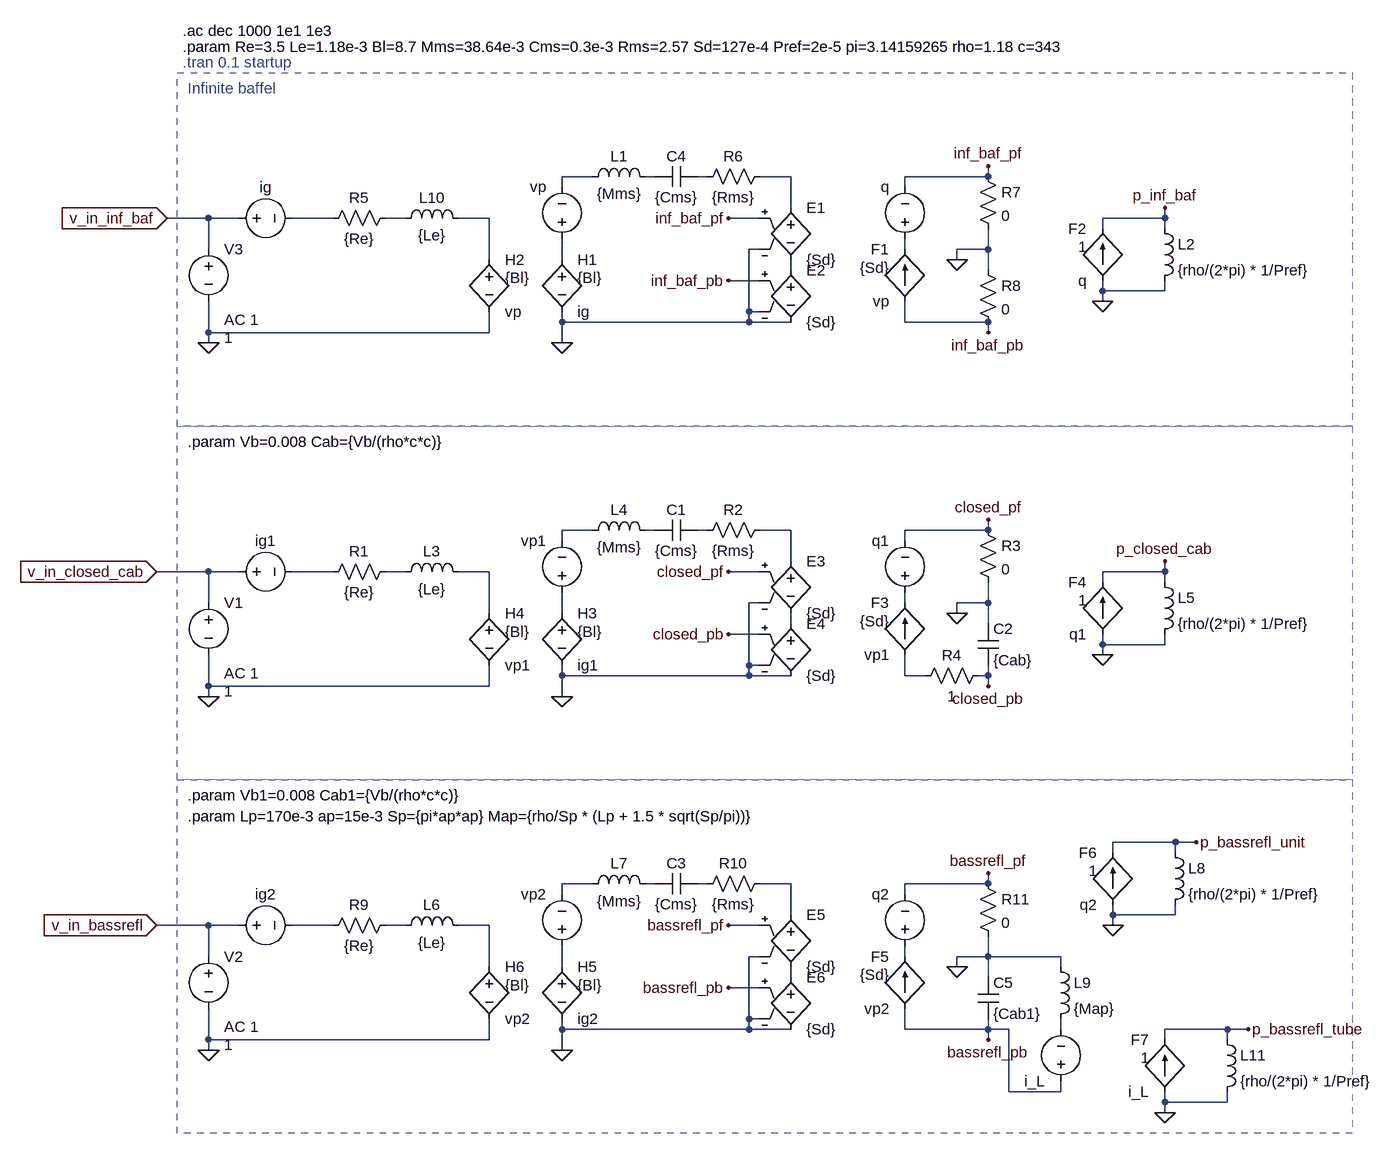
[diagram p0: schematic sim.asc]
sim.asc, the LTspice schematic file:
Version 4
SHEET 1 2408 1124
WIRE 704 -384 656 -384
WIRE 800 -384 784 -384
WIRE 880 -384 864 -384
WIRE 1008 -384 960 -384
WIRE 1312 -384 1312 -400
WIRE 1312 -384 1184 -384
WIRE 656 -368 656 -384
WIRE 1184 -368 1184 -384
WIRE 1008 -336 1008 -384
WIRE 112 -320 48 -320
WIRE 160 -320 112 -320
WIRE 304 -320 240 -320
WIRE 416 -320 384 -320
WIRE 544 -320 496 -320
WIRE 960 -320 912 -320
WIRE 1584 -320 1584 -336
WIRE 1584 -320 1488 -320
WIRE 1488 -304 1488 -320
WIRE 1584 -304 1584 -320
WIRE 112 -272 112 -320
WIRE 960 -272 944 -272
WIRE 1184 -272 1184 -288
WIRE 1312 -272 1312 -304
WIRE 1312 -272 1264 -272
WIRE 544 -256 544 -320
WIRE 656 -256 656 -288
WIRE 1264 -256 1264 -272
WIRE 1008 -240 1008 -256
WIRE 1312 -240 1312 -272
WIRE 960 -224 912 -224
WIRE 1488 -208 1488 -224
WIRE 1584 -208 1584 -224
WIRE 1584 -208 1488 -208
WIRE 1488 -192 1488 -208
WIRE 944 -176 944 -272
WIRE 960 -176 944 -176
WIRE 656 -160 656 -176
WIRE 944 -160 944 -176
WIRE 944 -160 656 -160
WIRE 1008 -160 944 -160
WIRE 1184 -160 1184 -192
WIRE 1312 -160 1184 -160
WIRE 112 -144 112 -192
WIRE 544 -144 544 -176
WIRE 544 -144 112 -144
WIRE 1312 -144 1312 -160
WIRE 112 -128 112 -144
WIRE 656 -128 656 -160
WIRE 704 160 656 160
WIRE 800 160 784 160
WIRE 880 160 864 160
WIRE 1008 160 960 160
WIRE 1312 160 1312 144
WIRE 1312 160 1184 160
WIRE 656 176 656 160
WIRE 1184 176 1184 160
WIRE 1008 208 1008 160
WIRE 112 224 32 224
WIRE 160 224 112 224
WIRE 304 224 240 224
WIRE 416 224 384 224
WIRE 544 224 496 224
WIRE 960 224 912 224
WIRE 1584 224 1584 208
WIRE 1584 224 1488 224
WIRE 1488 240 1488 224
WIRE 1584 240 1584 224
WIRE 112 272 112 224
WIRE 960 272 944 272
WIRE 1184 272 1184 256
WIRE 1312 272 1312 240
WIRE 1312 272 1264 272
WIRE 544 288 544 224
WIRE 656 288 656 256
WIRE 1264 288 1264 272
WIRE 1008 304 1008 288
WIRE 1312 304 1312 272
WIRE 960 320 912 320
WIRE 1488 336 1488 320
WIRE 1584 336 1584 320
WIRE 1584 336 1488 336
WIRE 1488 352 1488 336
WIRE 944 368 944 272
WIRE 960 368 944 368
WIRE 656 384 656 368
WIRE 944 384 944 368
WIRE 944 384 656 384
WIRE 1008 384 944 384
WIRE 1184 384 1184 352
WIRE 1216 384 1184 384
WIRE 1312 384 1312 368
WIRE 1312 384 1296 384
WIRE 112 400 112 352
WIRE 544 400 544 368
WIRE 544 400 112 400
WIRE 1312 400 1312 384
WIRE 112 416 112 400
WIRE 656 416 656 384
WIRE 1600 640 1504 640
WIRE 1632 640 1600 640
WIRE 1504 656 1504 640
WIRE 1600 656 1600 640
WIRE 704 704 656 704
WIRE 800 704 784 704
WIRE 880 704 864 704
WIRE 1008 704 960 704
WIRE 1312 704 1312 688
WIRE 1312 704 1184 704
WIRE 656 720 656 704
WIRE 1184 720 1184 704
WIRE 1008 752 1008 704
WIRE 1504 752 1504 736
WIRE 1600 752 1600 736
WIRE 1600 752 1504 752
WIRE 112 768 32 768
WIRE 160 768 112 768
WIRE 304 768 240 768
WIRE 416 768 384 768
WIRE 544 768 496 768
WIRE 960 768 912 768
WIRE 1504 768 1504 752
WIRE 112 816 112 768
WIRE 960 816 944 816
WIRE 1184 816 1184 800
WIRE 1312 816 1312 784
WIRE 1312 816 1264 816
WIRE 1424 816 1312 816
WIRE 544 832 544 768
WIRE 656 832 656 800
WIRE 1264 832 1264 816
WIRE 1424 832 1424 816
WIRE 1008 848 1008 832
WIRE 1312 848 1312 816
WIRE 960 864 912 864
WIRE 944 912 944 816
WIRE 960 912 944 912
WIRE 656 928 656 912
WIRE 944 928 944 912
WIRE 944 928 656 928
WIRE 1008 928 944 928
WIRE 1184 928 1184 896
WIRE 1312 928 1312 912
WIRE 1312 928 1184 928
WIRE 1344 928 1312 928
WIRE 1424 928 1424 912
WIRE 1680 928 1584 928
WIRE 1712 928 1680 928
WIRE 112 944 112 896
WIRE 544 944 544 912
WIRE 544 944 112 944
WIRE 1312 944 1312 928
WIRE 1584 944 1584 928
WIRE 1680 944 1680 928
WIRE 112 960 112 944
WIRE 656 960 656 928
WIRE 1344 1024 1344 928
WIRE 1424 1024 1424 1008
WIRE 1424 1024 1344 1024
WIRE 1584 1040 1584 1024
WIRE 1680 1040 1680 1024
WIRE 1680 1040 1584 1040
WIRE 1584 1056 1584 1040
FLAG 112 -128 0
FLAG 656 -128 0
FLAG 1264 -256 0
FLAG 1488 -192 0
FLAG 1312 -400 inf_baf_pf
FLAG 1312 -144 inf_baf_pb
FLAG 912 -320 inf_baf_pf
FLAG 912 -224 inf_baf_pb
FLAG 112 416 0
FLAG 656 416 0
FLAG 1264 288 0
FLAG 1488 352 0
FLAG 1312 144 closed_pf
FLAG 912 224 closed_pf
FLAG 912 320 closed_pb
FLAG 1312 400 closed_pb
FLAG 48 -320 v_in_inf_baf
IOPIN 48 -320 In
FLAG 32 224 v_in_closed_cab
IOPIN 32 224 In
FLAG 1584 -336 p_inf_baf
FLAG 1584 208 p_closed_cab
FLAG 112 960 0
FLAG 656 960 0
FLAG 1264 832 0
FLAG 1504 768 0
FLAG 1312 688 bassrefl_pf
FLAG 912 768 bassrefl_pf
FLAG 912 864 bassrefl_pb
FLAG 1312 944 bassrefl_pb
FLAG 32 768 v_in_bassrefl
IOPIN 32 768 In
FLAG 1632 640 p_bassrefl_unit
FLAG 1584 1056 0
FLAG 1712 928 p_bassrefl_tube
SYMBOL voltage 112 -288 R0
WINDOW 3 24 152 Left 2
WINDOW 123 24 124 Left 2
WINDOW 39 0 0 Left 0
SYMATTR Value 1
SYMATTR Value2 AC 1
SYMATTR InstName V3
SYMBOL res 400 -336 R90
WINDOW 0 0 56 VBottom 2
WINDOW 3 32 56 VTop 2
SYMATTR InstName R5
SYMATTR Value {Re}
SYMBOL ind 400 -304 R270
WINDOW 0 32 56 VTop 2
WINDOW 3 5 56 VBottom 2
SYMATTR InstName L10
SYMATTR Value {Le}
SYMBOL voltage 144 -320 R270
WINDOW 0 32 56 VTop 2
WINDOW 3 -32 56 VBottom 2
SYMATTR InstName ig
SYMATTR Value ""
SYMBOL ind 688 -368 R270
WINDOW 0 32 56 VTop 2
WINDOW 3 5 56 VBottom 2
SYMATTR InstName L1
SYMATTR Value {Mms}
SYMBOL cap 864 -400 R90
WINDOW 0 0 32 VBottom 2
WINDOW 3 32 32 VTop 2
SYMATTR InstName C4
SYMATTR Value {Cms}
SYMBOL res 976 -400 R90
WINDOW 0 0 56 VBottom 2
WINDOW 3 32 56 VTop 2
SYMATTR InstName R6
SYMATTR Value {Rms}
SYMBOL voltage 656 -272 R180
WINDOW 0 24 96 Left 2
WINDOW 3 24 16 Left 2
SYMATTR InstName vp
SYMATTR Value ""
SYMBOL h 656 -272 R0
WINDOW 123 24 44 Left 2
SYMATTR InstName H1
SYMATTR Value ig
SYMATTR Value2 {Bl}
SYMBOL h 544 -272 R0
WINDOW 123 24 44 Left 2
SYMATTR InstName H2
SYMATTR Value vp
SYMATTR Value2 {Bl}
SYMBOL f 1184 -192 R180
WINDOW 0 24 80 Left 2
WINDOW 3 24 0 Left 2
WINDOW 123 24 52 Left 2
SYMATTR InstName F1
SYMATTR Value vp
SYMATTR Value2 {Sd}
SYMBOL res 1296 -400 R0
SYMATTR InstName R7
SYMATTR Value 0
SYMBOL res 1296 -256 R0
SYMATTR InstName R8
SYMATTR Value 0
SYMBOL voltage 1184 -272 R180
WINDOW 0 24 96 Left 2
WINDOW 3 24 16 Left 2
SYMATTR InstName q
SYMATTR Value ""
SYMBOL ind 1568 -320 R0
SYMATTR InstName L2
SYMATTR Value {rho/(2*pi) * 1/Pref}
SYMBOL f 1488 -224 R180
WINDOW 0 24 80 Left 2
WINDOW 3 24 0 Left 2
WINDOW 123 24 52 Left 2
SYMATTR InstName F2
SYMATTR Value q
SYMATTR Value2 1
SYMBOL e 1008 -352 R0
SYMATTR InstName E1
SYMATTR Value {Sd}
SYMBOL e 1008 -256 R0
SYMATTR InstName E2
SYMATTR Value {Sd}
SYMBOL voltage 112 256 R0
WINDOW 3 24 152 Left 2
WINDOW 123 24 124 Left 2
WINDOW 39 0 0 Left 0
SYMATTR Value 1
SYMATTR Value2 AC 1
SYMATTR InstName V1
SYMBOL res 400 208 R90
WINDOW 0 0 56 VBottom 2
WINDOW 3 32 56 VTop 2
SYMATTR InstName R1
SYMATTR Value {Re}
SYMBOL ind 400 240 R270
WINDOW 0 32 56 VTop 2
WINDOW 3 5 56 VBottom 2
SYMATTR InstName L3
SYMATTR Value {Le}
SYMBOL voltage 144 224 R270
WINDOW 0 32 56 VTop 2
WINDOW 3 -32 56 VBottom 2
SYMATTR InstName ig1
SYMATTR Value ""
SYMBOL ind 688 176 R270
WINDOW 0 32 56 VTop 2
WINDOW 3 5 56 VBottom 2
SYMATTR InstName L4
SYMATTR Value {Mms}
SYMBOL cap 864 144 R90
WINDOW 0 0 32 VBottom 2
WINDOW 3 32 32 VTop 2
SYMATTR InstName C1
SYMATTR Value {Cms}
SYMBOL res 976 144 R90
WINDOW 0 0 56 VBottom 2
WINDOW 3 32 56 VTop 2
SYMATTR InstName R2
SYMATTR Value {Rms}
SYMBOL voltage 656 272 R180
WINDOW 0 24 96 Left 2
WINDOW 3 24 16 Left 2
SYMATTR InstName vp1
SYMATTR Value ""
SYMBOL h 656 272 R0
WINDOW 123 24 44 Left 2
SYMATTR InstName H3
SYMATTR Value ig1
SYMATTR Value2 {Bl}
SYMBOL h 544 272 R0
WINDOW 123 24 44 Left 2
SYMATTR InstName H4
SYMATTR Value vp1
SYMATTR Value2 {Bl}
SYMBOL f 1184 352 R180
WINDOW 0 24 80 Left 2
WINDOW 3 24 0 Left 2
WINDOW 123 24 52 Left 2
SYMATTR InstName F3
SYMATTR Value vp1
SYMATTR Value2 {Sd}
SYMBOL res 1296 144 R0
SYMATTR InstName R3
SYMATTR Value 0
SYMBOL voltage 1184 272 R180
WINDOW 0 24 96 Left 2
WINDOW 3 24 16 Left 2
SYMATTR InstName q1
SYMATTR Value ""
SYMBOL ind 1568 224 R0
SYMATTR InstName L5
SYMATTR Value {rho/(2*pi) * 1/Pref}
SYMBOL f 1488 320 R180
WINDOW 0 24 80 Left 2
WINDOW 3 24 0 Left 2
WINDOW 123 24 52 Left 2
SYMATTR InstName F4
SYMATTR Value q1
SYMATTR Value2 1
SYMBOL e 1008 192 R0
SYMATTR InstName E3
SYMATTR Value {Sd}
SYMBOL e 1008 288 R0
SYMATTR InstName E4
SYMATTR Value {Sd}
SYMBOL cap 1296 304 R0
SYMATTR InstName C2
SYMATTR Value {Cab}
SYMBOL res 1312 368 R90
WINDOW 0 0 56 VBottom 2
WINDOW 3 32 56 VTop 2
SYMATTR InstName R4
SYMATTR Value 1
SYMBOL voltage 112 800 R0
WINDOW 3 24 152 Left 2
WINDOW 123 24 124 Left 2
WINDOW 39 0 0 Left 0
SYMATTR Value 1
SYMATTR Value2 AC 1
SYMATTR InstName V2
SYMBOL res 400 752 R90
WINDOW 0 0 56 VBottom 2
WINDOW 3 32 56 VTop 2
SYMATTR InstName R9
SYMATTR Value {Re}
SYMBOL ind 400 784 R270
WINDOW 0 32 56 VTop 2
WINDOW 3 5 56 VBottom 2
SYMATTR InstName L6
SYMATTR Value {Le}
SYMBOL voltage 144 768 R270
WINDOW 0 32 56 VTop 2
WINDOW 3 -32 56 VBottom 2
SYMATTR InstName ig2
SYMATTR Value ""
SYMBOL ind 688 720 R270
WINDOW 0 32 56 VTop 2
WINDOW 3 5 56 VBottom 2
SYMATTR InstName L7
SYMATTR Value {Mms}
SYMBOL cap 864 688 R90
WINDOW 0 0 32 VBottom 2
WINDOW 3 32 32 VTop 2
SYMATTR InstName C3
SYMATTR Value {Cms}
SYMBOL res 976 688 R90
WINDOW 0 0 56 VBottom 2
WINDOW 3 32 56 VTop 2
SYMATTR InstName R10
SYMATTR Value {Rms}
SYMBOL voltage 656 816 R180
WINDOW 0 24 96 Left 2
WINDOW 3 24 16 Left 2
SYMATTR InstName vp2
SYMATTR Value ""
SYMBOL h 656 816 R0
WINDOW 123 24 44 Left 2
SYMATTR InstName H5
SYMATTR Value ig2
SYMATTR Value2 {Bl}
SYMBOL h 544 816 R0
WINDOW 123 24 44 Left 2
SYMATTR InstName H6
SYMATTR Value vp2
SYMATTR Value2 {Bl}
SYMBOL f 1184 896 R180
WINDOW 0 24 80 Left 2
WINDOW 3 24 0 Left 2
WINDOW 123 24 52 Left 2
SYMATTR InstName F5
SYMATTR Value vp2
SYMATTR Value2 {Sd}
SYMBOL res 1296 688 R0
SYMATTR InstName R11
SYMATTR Value 0
SYMBOL voltage 1184 816 R180
WINDOW 0 24 96 Left 2
WINDOW 3 24 16 Left 2
SYMATTR InstName q2
SYMATTR Value ""
SYMBOL ind 1584 640 R0
SYMATTR InstName L8
SYMATTR Value {rho/(2*pi) * 1/Pref}
SYMBOL f 1504 736 R180
WINDOW 0 24 80 Left 2
WINDOW 3 24 0 Left 2
WINDOW 123 24 52 Left 2
SYMATTR InstName F6
SYMATTR Value q2
SYMATTR Value2 1
SYMBOL e 1008 736 R0
SYMATTR InstName E5
SYMATTR Value {Sd}
SYMBOL e 1008 832 R0
SYMATTR InstName E6
SYMATTR Value {Sd}
SYMBOL cap 1296 848 R0
SYMATTR InstName C5
SYMATTR Value {Cab1}
SYMBOL ind 1408 816 R0
SYMATTR InstName L9
SYMATTR Value {Map}
SYMBOL ind 1664 928 R0
SYMATTR InstName L11
SYMATTR Value {rho/(2*pi) * 1/Pref}
SYMBOL f 1584 1024 R180
WINDOW 0 24 80 Left 2
WINDOW 3 24 0 Left 2
WINDOW 123 24 52 Left 2
SYMATTR InstName F7
SYMATTR Value i_L
SYMATTR Value2 1
SYMBOL voltage 1424 1024 R180
WINDOW 123 0 0 Left 0
WINDOW 39 0 0 Left 0
SYMATTR InstName i_L
SYMATTR Value ""
TEXT 72 -608 Left 2 !.ac dec 1000 1e1 1e3
TEXT 72 -584 Left 2 !.param Re=3.5 Le=1.18e-3 Bl=8.7 Mms=38.64e-3 Cms=0.3e-3 Rms=2.57 Sd=127e-4 Pref=2e-5 pi=3.14159265 rho=1.18 c=343
TEXT 72 -560 Left 2 ;.tran 0.1 startup
TEXT 80 -520 Left 2 ;Infinite baffel
TEXT 80 24 Left 2 !.param Vb=0.008 Cab={Vb/(rho*c*c)}
TEXT 80 568 Left 2 !.param Vb1=0.008 Cab1={Vb/(rho*c*c)}
TEXT 80 600 Left 2 !.param Lp=170e-3 ap=15e-3 Sp={pi*ap*ap} Map={rho/Sp * (Lp + 1.5 * sqrt(Sp/pi))}
RECTANGLE Normal 1872 0 64 -544 2
RECTANGLE Normal 1872 544 64 0 2
RECTANGLE Normal 1872 1088 64 544 2

The netlist it stands for:
* sim.asc
V3 v_in_inf_baf 0 1 AC 1
R5 N006 N005 {Re}
L10 N006 N007 {Le}
V§ig v_in_inf_baf N005
L1 N001 N002 {Mms}
C4 N003 N002 {Cms}
R6 N004 N003 {Rms}
vp N009 N001
H1 N009 0 ig {Bl}
H2 N007 0 vp {Bl}
F1 inf_baf_pb N008 vp {Sd}
R7 inf_baf_pf 0 0
R8 0 inf_baf_pb 0
V§q N008 inf_baf_pf
L2 p_inf_baf 0 {rho/(2*pi) * 1/Pref}
F2 0 p_inf_baf q 1
E1 N004 N010 inf_baf_pf 0 {Sd}
E2 N010 0 inf_baf_pb 0 {Sd}
V1 v_in_closed_cab 0 1 AC 1
R1 N016 N015 {Re}
L3 N016 N017 {Le}
V§ig1 v_in_closed_cab N015
L4 N011 N012 {Mms}
C1 N013 N012 {Cms}
R2 N014 N013 {Rms}
vp1 N019 N011
H3 N019 0 ig1 {Bl}
H4 N017 0 vp1 {Bl}
F3 N021 N018 vp1 {Sd}
R3 closed_pf 0 0
V§q1 N018 closed_pf
L5 p_closed_cab 0 {rho/(2*pi) * 1/Pref}
F4 0 p_closed_cab q1 1
E3 N014 N020 closed_pf 0 {Sd}
E4 N020 0 closed_pb 0 {Sd}
C2 0 closed_pb {Cab}
R4 closed_pb N021 1
V2 v_in_bassrefl 0 1 AC 1
R9 N027 N026 {Re}
L6 N027 N028 {Le}
V§ig2 v_in_bassrefl N026
L7 N022 N023 {Mms}
C3 N024 N023 {Cms}
R10 N025 N024 {Rms}
vp2 N030 N022
H5 N030 0 ig2 {Bl}
H6 N028 0 vp2 {Bl}
F5 bassrefl_pb N029 vp2 {Sd}
R11 bassrefl_pf 0 0
V§q2 N029 bassrefl_pf
L8 p_bassrefl_unit 0 {rho/(2*pi) * 1/Pref}
F6 0 p_bassrefl_unit q2 1
E5 N025 N031 bassrefl_pf 0 {Sd}
E6 N031 0 bassrefl_pb 0 {Sd}
C5 0 bassrefl_pb {Cab1}
L9 0 N032 {Map}
L11 p_bassrefl_tube 0 {rho/(2*pi) * 1/Pref}
F7 0 p_bassrefl_tube i_L 1
V§i_L bassrefl_pb N032
.ac dec 1000 1e1 1e3
.param Re=3.5 Le=1.18e-3 Bl=8.7 Mms=38.64e-3 Cms=0.3e-3 Rms=2.57 Sd=127e-4 Pref=2e-5 pi=3.14159265 rho=1.18 c=343
* .tran 0.1 startup
* Infinite baffel
.param Vb=0.008 Cab={Vb/(rho*c*c)}
.param Vb1=0.008 Cab1={Vb/(rho*c*c)}
.param Lp=170e-3 ap=15e-3 Sp={pi*ap*ap} Map={rho/Sp * (Lp + 1.5 * sqrt(Sp/pi))}
.backanno
.end